# Altium schematic sheet Isolated_Power.SchDoc: Isolated power
size A4; Engineer: Danel Tiitma; DocumentNumber: 13; Revision: 1; SheetNumber: 14; SheetTotal: 15
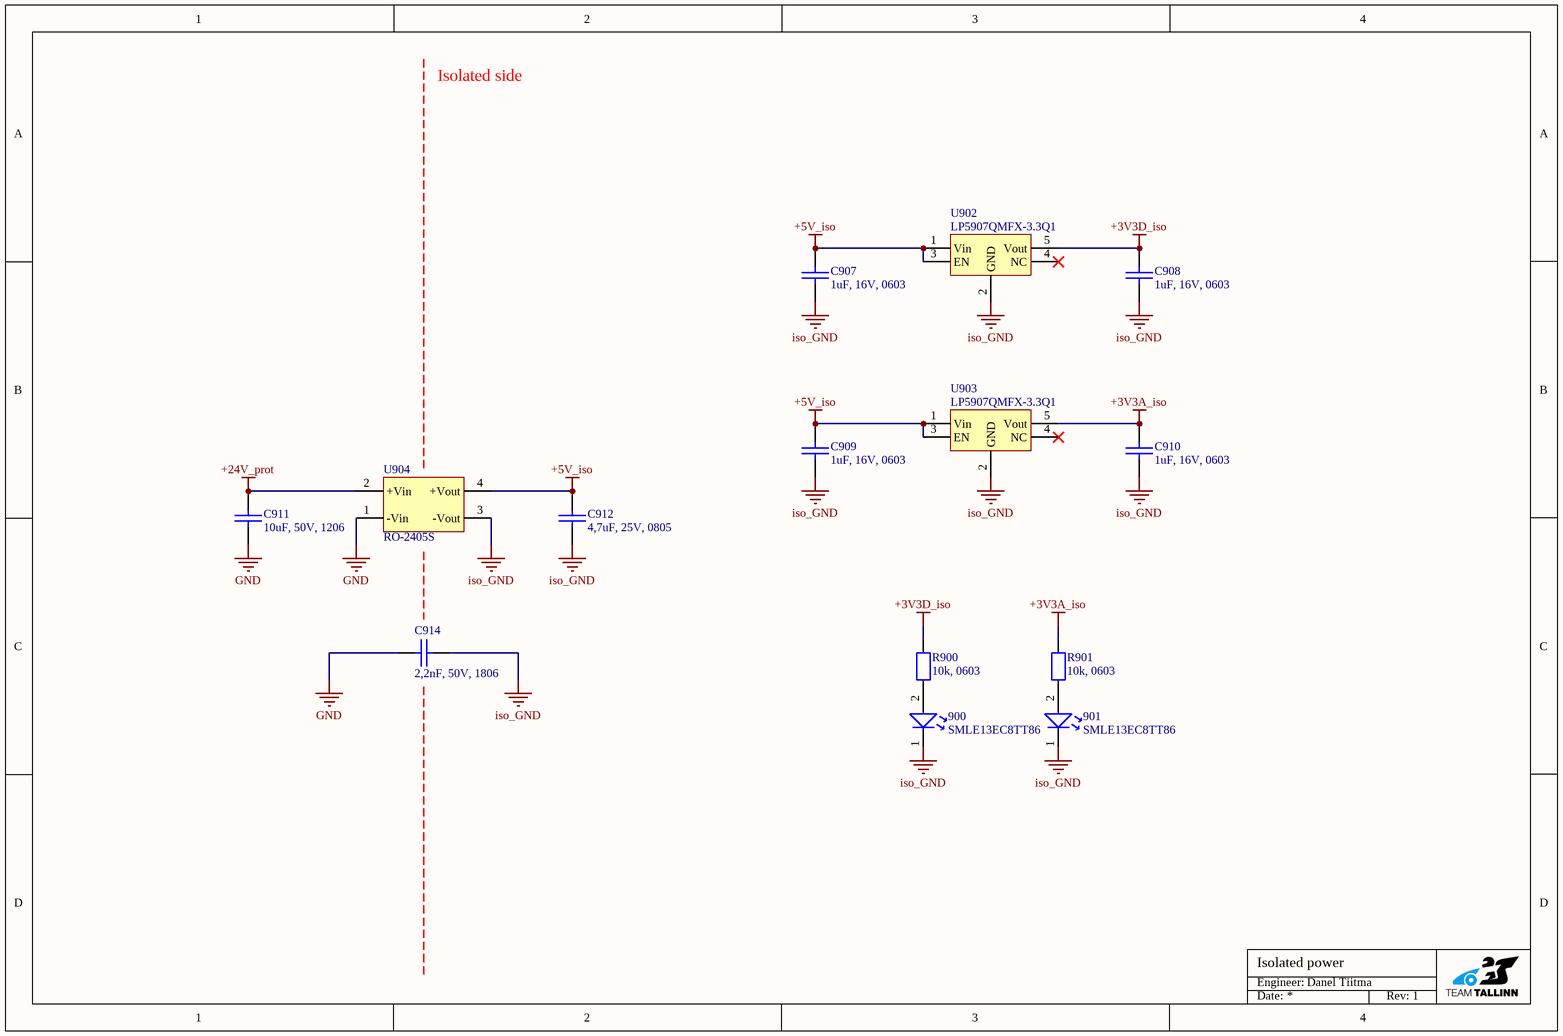
[diagram p0: Isolated_Power.SchDoc]

## Parts
900  SMLE13EC8TT86  [LED [0603] 1608]
901  SMLE13EC8TT86  [LED [0603] 1608]
C907  1uF, 16V, 0603  [CAP [0603] 1608]
C908  1uF, 16V, 0603  [CAP [0603] 1608]
C909  1uF, 16V, 0603  [CAP [0603] 1608]
C910  1uF, 16V, 0603  [CAP [0603] 1608]
C911  10uF, 50V, 1206  [CAP [1206] 3216]
C912  4,7uF, 25V, 0805  [CAP [0805] 2012]
C914  2,2nF, 50V, 1806  [CAP [1806] 4516]
R900  10k, 0603  [RES [0603] 1608]
R901  10k, 0603  [RES [0603] 1608]
U902  LP5907QMFX-3.3Q1  [SOT23-5]
U903  LP5907QMFX-3.3Q1  [SOT23-5]
U904  RO-2405S  [SIP-4]

## Nets
+3V3A_iso: C910.2 R901.2 U903.5(Vout)
+3V3D_iso: C908.2 R900.2 U902.5(Vout)
+5V_iso: C907.2 C909.2 C912.2 U902.1(Vin) U902.3(EN) U903.1(Vin) U903.3(EN) U904.4(+Vout)
+24V_prot: C911.2 U904.2(+Vin)
GND: C911.1 C914.1 U904.1(-Vin)
iso_GND: 900.1 901.1 C907.1 C908.1 C909.1 C910.1 C912.1 C914.2 U902.2(GND) U903.2(GND) U904.3(-Vout)
Net900_2: 900.2 R900.1
Net901_2: 901.2 R901.1

Not connected (* = marked no-connect by the designer): U902 4(NC)*; U903 4(NC)*

## Notes on the sheet
- Isolated side
- Engineer:
- Date:
- Rev:

## Library data of the parts
900 901 = CMP-004-00006-2: Single Color LED, Green, Colorless Transparent, 1.2mm; Manufacturer Part Number: SMLE13EC8TT86; Supplier Part Number: 755-SMLE13EC8TT86; Supplier: Mouser
C907-C912 C914 = CMP-001-00084-16: Default capacitor part; Supplier Part Number: *; Supplier: *; Manufacturer Part Number: *
R900 R901 = CMP-009-00038-12: Standard resistor part; Supplier Part Number: *; Manufacturer Part Number: *; Supplier: *
U902 U903 = CMP-019-00018-1: Fixed Positive LDO Regulator, 3.3V, 0.25V Dropout, PDSO5; Manufacturer: Texas Instruments; Manufacturer Part Number: LP5907QMFX-3.3Q1; Supplier Part Number: 595-LP5907QMFX-3.3Q1; Supplier: Mouser
U904 = CMP-019-00004-3: DC-DC Unregulated Power Supply Module, 1 Output, 1W, Hybrid; Manufacturer: Recom Power; Supplier: Digikey; Price: 6.99; Supplier Part Number: 945-1225-ND; Manufacturer Part Number: RO-2405S